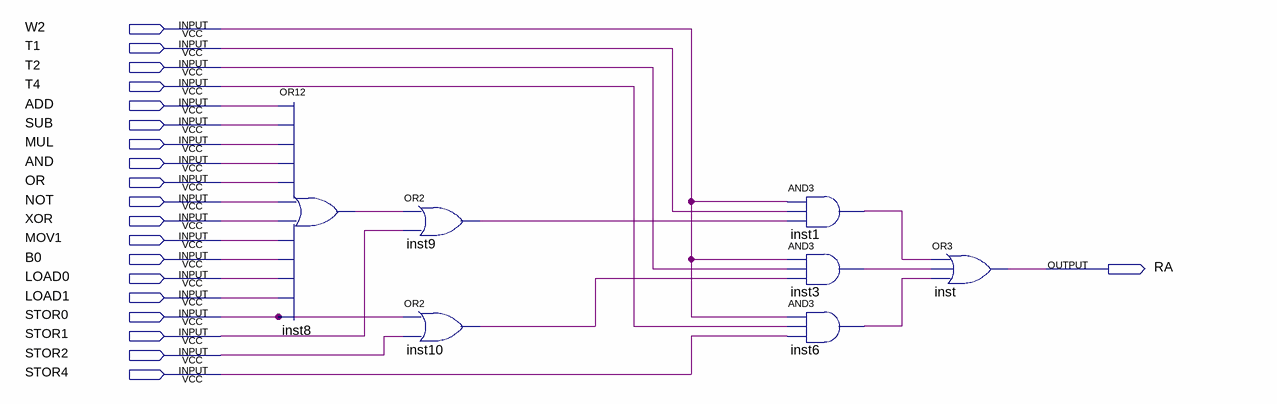
[diagram p0: schematic sheet]
// Quartus schematic RA.bdf as structural Verilog: 7 symbols, 20 pins
module RA (
  input  W2,
  input  T1,
  input  T2,
  input  T4,
  input  ADD,
  input  SUB,
  input  MUL,
  input  AND,
  input  OR,
  input  NOT,
  input  XOR,
  input  MOV1,
  input  B0,
  input  LOAD0,
  input  LOAD1,
  input  STOR0,
  input  STOR1,
  input  STOR2,
  input  STOR4,
  output RA
);

  wire inst1_out, inst3_out, inst6_out, inst8_out, inst9_out, inst10_out;

  or inst8 (inst8_out, ADD, SUB, MUL, AND, OR, NOT, XOR, MOV1, B0, LOAD0, LOAD1, STOR0);
  or inst9 (inst9_out, inst8_out, STOR1);
  or inst10 (inst10_out, STOR0, STOR2);
  and inst1 (inst1_out, W2, T1, inst9_out);
  and inst3 (inst3_out, W2, T2, inst10_out);
  and inst6 (inst6_out, W2, T4, STOR4);
  or inst (RA, inst1_out, inst3_out, inst6_out);
endmodule
